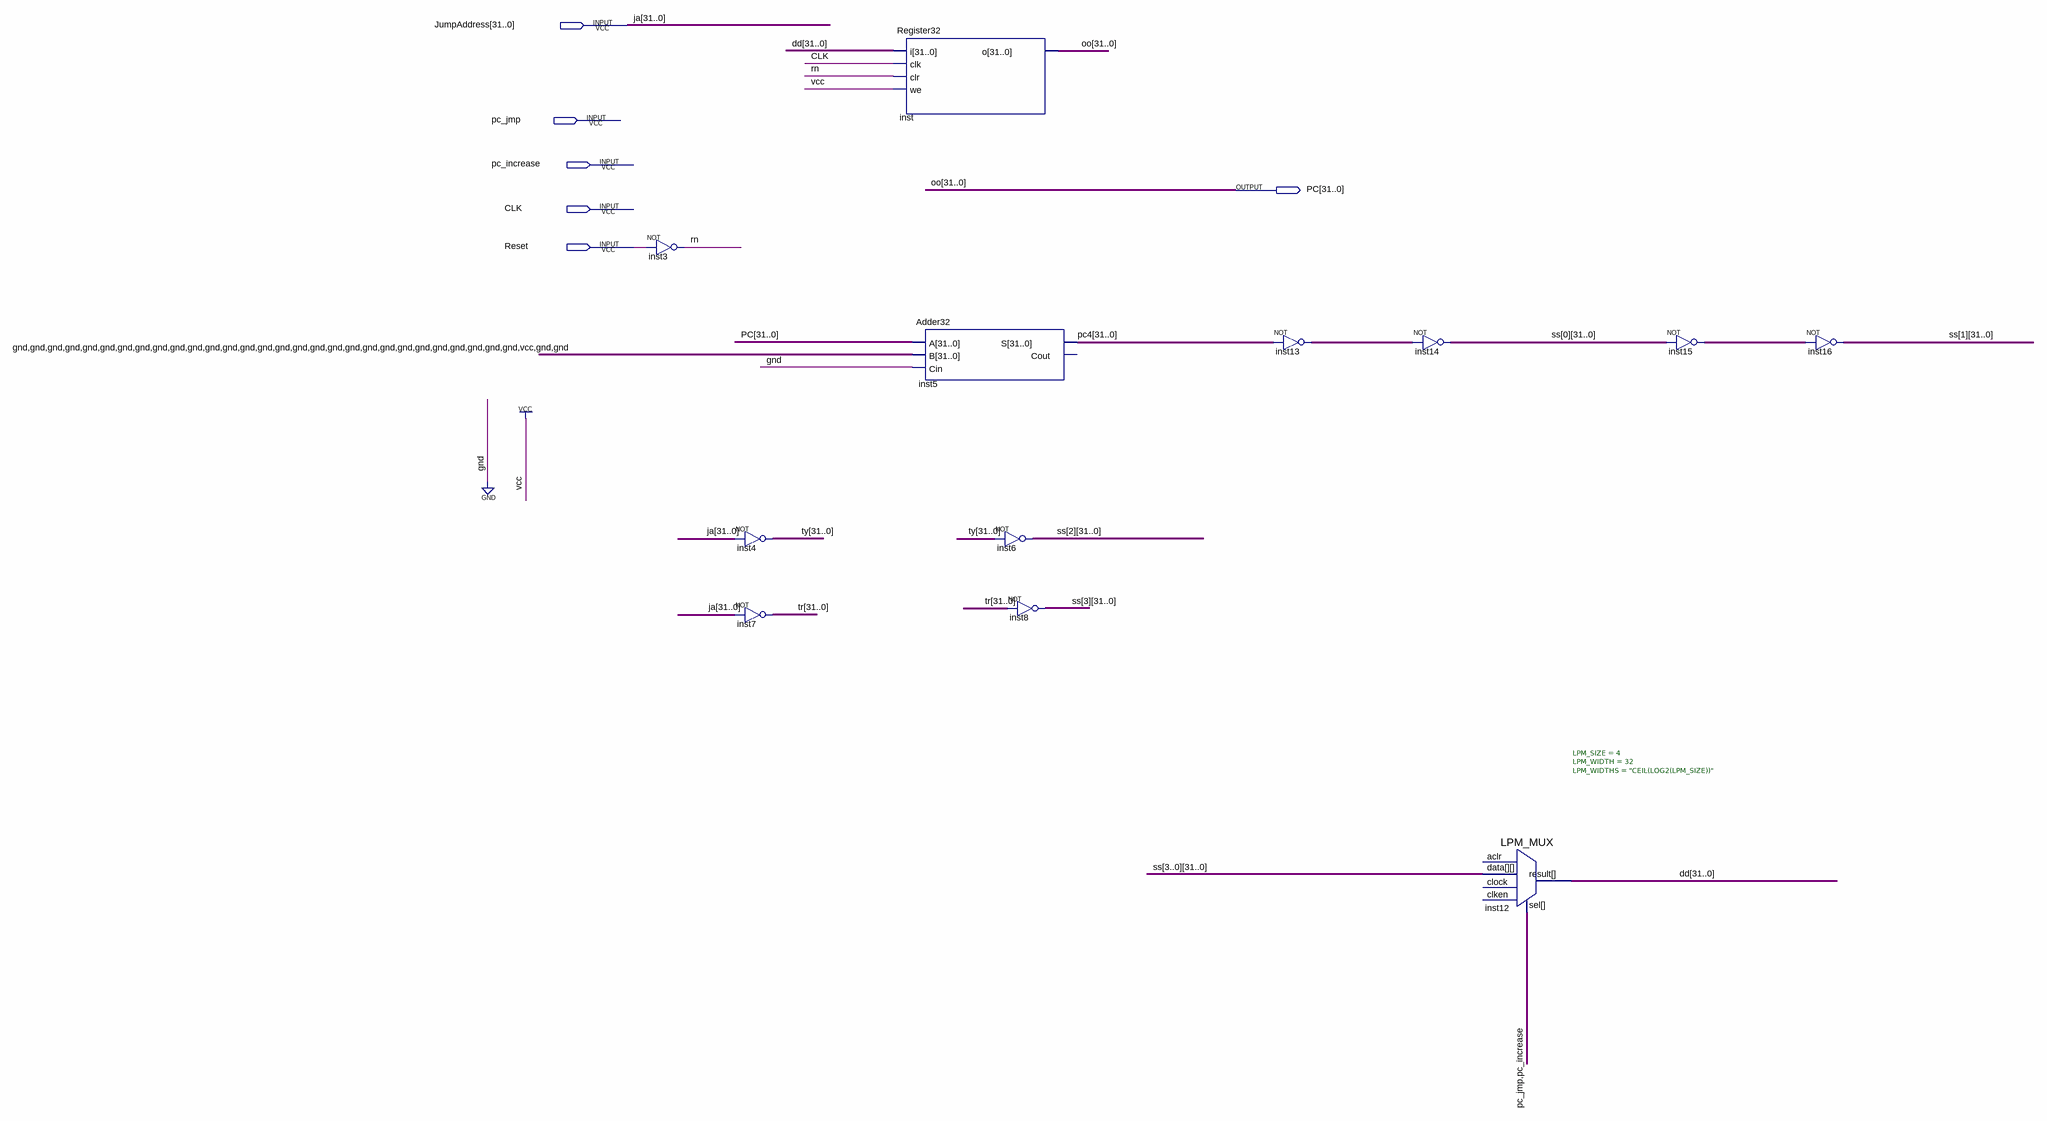
[diagram p0: schematic sheet]
// Quartus schematic PC.bdf as structural Verilog: 12 symbols, 6 pins
module PC (
  input  [31:0] JumpAddress,
  input  pc_jmp,
  input  pc_increase,
  input  CLK,
  input  Reset,
  output [31:0] PC
);

  wire rn;
  wire [31:0] dd, inst13_out, inst15_out, pc4, ss_0, ss_1, ss_2, ss_3, tr, ty;

  not inst3 (rn, Reset);
  assign ty = ~JumpAddress;  // NOT inst4, 32 bits wide
  assign tr = ~JumpAddress;  // NOT inst7, 32 bits wide
  Register32 inst (.i(dd), .clk(CLK), .clr(rn), .we(1'b1), .o(PC));
  Adder32 inst5 (.A(PC), .B(32'b00000000000000000000000000000100), .Cin(1'b0), .S(pc4));  // open: Cout
  assign ss_2 = ~ty;  // NOT inst6, 32 bits wide
  assign ss_3 = ~tr;  // NOT inst8, 32 bits wide
  assign inst13_out = ~pc4;  // NOT inst13, 32 bits wide
  assign ss_0 = ~inst13_out;  // NOT inst14, 32 bits wide
  LPM_MUX #(.LPM_SIZE(4), .LPM_WIDTH(32), .LPM_WIDTHS("CEIL(LOG2(LPM_SIZE))")) inst12 (
    .data({ss_3, ss_2, ss_1, ss_0}), .sel({pc_jmp, pc_increase}), .result(dd));  // open: clock, aclr, clken
  assign inst15_out = ~ss_0;  // NOT inst15, 32 bits wide
  assign ss_1 = ~inst15_out;  // NOT inst16, 32 bits wide

  // Other names for the same wires on the sheet: ja[31:0] = JumpAddress; oo[31:0] = PC
endmodule
